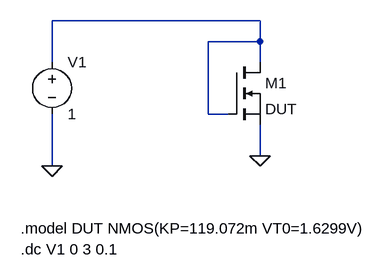
[diagram p0: schematic 2027 Lab 2.asc]
2027 Lab 2.asc, the LTspice schematic file:
Version 4
SHEET 1 880 680
WIRE 352 32 32 32
WIRE 352 64 352 32
WIRE 352 64 272 64
WIRE 32 96 32 32
WIRE 352 96 352 64
WIRE 272 176 272 64
WIRE 304 176 272 176
WIRE 352 240 352 192
WIRE 32 256 32 176
FLAG 32 256 0
FLAG 352 240 0
SYMBOL voltage 32 80 R0
WINDOW 123 0 0 Left 0
WINDOW 39 0 0 Left 0
SYMATTR InstName V1
SYMATTR Value 1
SYMBOL nmos 304 96 R0
SYMATTR InstName M1
SYMATTR Value DUT
TEXT -16 352 Left 2 !.model DUT NMOS(KP=119.072m VT0=1.6299V)
TEXT -16 384 Left 2 !.dc V1 0 3 0.1

The netlist it stands for:
* 2027 Lab 2.asc
V1 N001 0 1
M1 N001 N001 0 0 DUT
.model NMOS NMOS
.model PMOS PMOS
.lib standard.mos
.model DUT NMOS(KP=119.072m VT0=1.6299V)
.dc V1 0 3 0.1
.backanno
.end